# EAGLE design 086-005 (EAGLE 7.5.0)
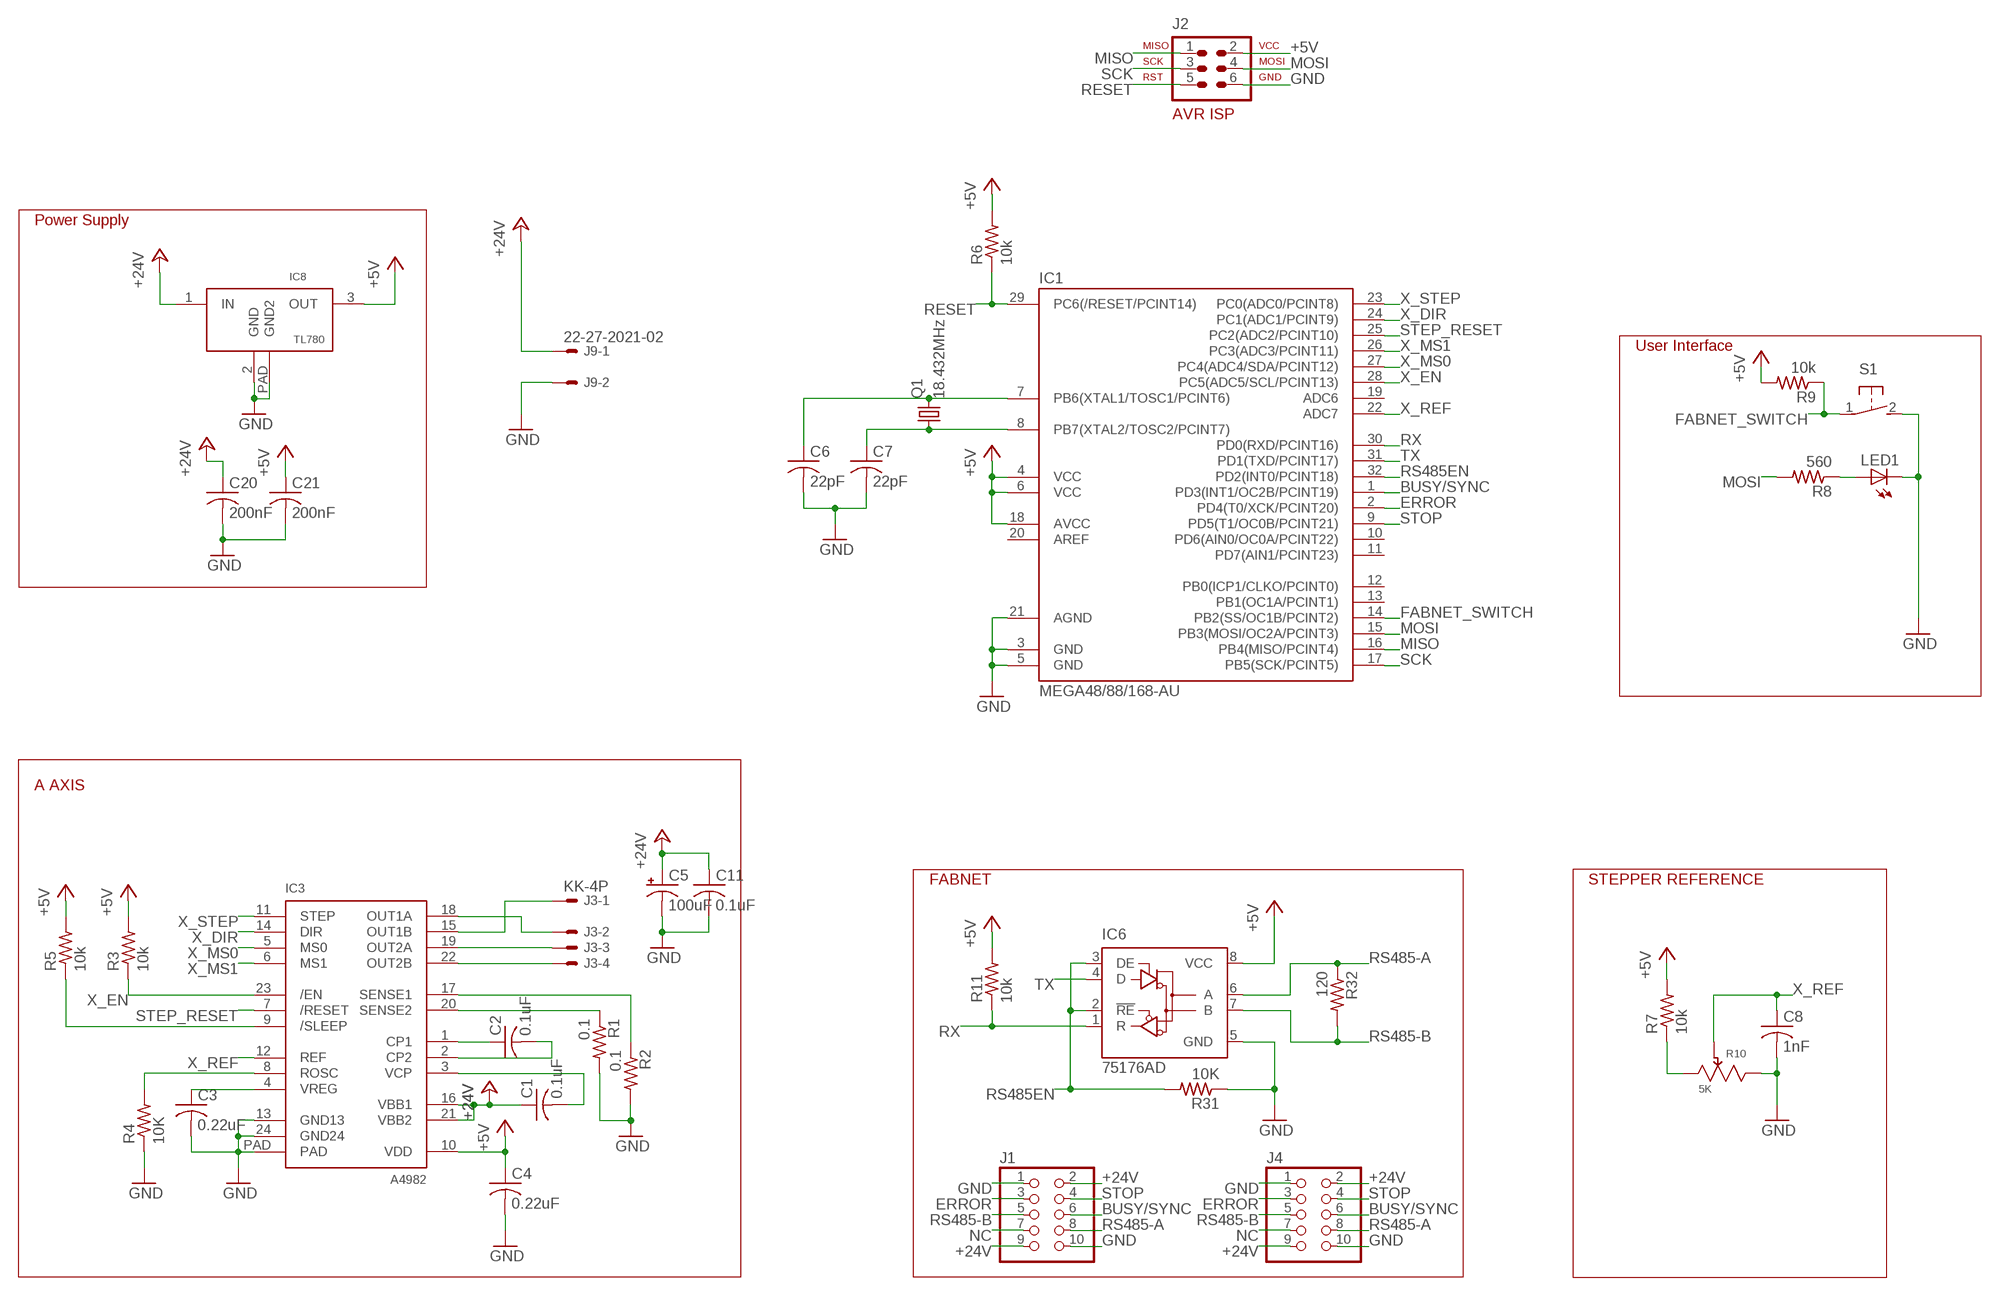
[diagram p0: schematic, sheet 1]

## Parts
C1  0.1uF  C-USC0805  [C0805]
C2  0.1uF  C-USC0805  [C0805]
C3  0.22uF  C-USC0805  [C0805]
C4  0.22uF  C-USC0805  [C0805]
C5  100uF  CPOL-USD  [PANASONIC_D]
C6  22pF  C-USC0805  [C0805]
C7  22pF  C-USC0805  [C0805]
C8  1nF  C-USC0805  [C0805]
C11  0.1uF  C-USC0805  [C0805]
C20  200nF  C-USC0805  [C0805]
C21  200nF  C-USC0805  [C0805]
IC1  MEGA48/88/168-AU  [TQFP32-08]
IC3  A4982  [TSSOP24_LP]
IC6  75176AD  [D_R-PDSO-G8]
IC8  TL780_VREG  [D2PAK-3]
J1  PINHD-2X5  [2X05]
J2  AVR-ISP-6VERT  [AVR-ISP-6]
J3  KK-4P  22-05-7048-04  [7395-04]
J4  PINHD-2X5  [2X05]
J9  22-27-2021-02  [6410-02]
LED1  LEDCHIPLED_0603  [CHIPLED_0603]
Q1  18.432MHz  CRYSTALHC49UP  [HC49UP]
R1  0.1  R-US_R1206  [R1206]
R2  0.1  R-US_R1206  [R1206]
R3  10k  R-US_R0805  [R0805]
R4  10K  R-US_R0805  [R0805]
R5  10k  R-US_R0805  [R0805]
R6  10k  R-US_R0805  [R0805]
R7  10k  R-US_R0805  [R0805]
R8  560  R-US_R0805  [R0805]
R9  10k  R-US_R0805  [R0805]
R10  5K  BOURN_POT  [BOURN_TRIM]
R11  10k  R-US_R0805  [R0805]
R31  10K  R-US_R0805  [R0805]
R32  120  R-US_R0805  [R0805]
S1  31-XX  [B3F-31XX]

## Nets
+5V: C4.1 C21.1 IC1.4(VCC) IC1.6(VCC) IC1.18(AVCC) IC3.10(VDD) IC6.8(VCC) IC8.3(OUT) J2.2 R3.2 R5.2 R6.2 R7.2 R9.2 R11.2
+24V: C1.1 C5.+ C11.1 C20.1 IC3.16(VBB1) IC3.21(VBB2) IC8.1(IN) J1.2 J1.9 J4.2 J4.9 J9.1
BUSY/SYNC: IC1.1(PD3(INT1/OC2B/PCINT19)) J1.6 J4.6
ERROR: IC1.2(PD4(T0/XCK/PCINT20)) J1.3 J4.3
FABNET_SWITCH: IC1.14(PB2(SS/OC1B/PCINT2)) R9.1 S1.1(P)
GND: C3.2 C4.2 C5.- C6.2 C7.2 C8.2 C11.2 C20.2 C21.2 IC1.3(GND) IC1.5(GND) IC1.21(AGND) IC3.13(GND13) IC3.24(GND24) IC3.PAD IC6.5(GND) IC8.2(GND) IC8.PAD(GND2) J1.1 J1.10 J2.6 J4.1 J4.10 J9.2 LED1.C R1.2 R2.2 R4.1 R10.3 R31.1 S1.2(S)
MISO: IC1.16(PB4(MISO/PCINT4)) J2.1
MOSI: IC1.15(PB3(MOSI/OC2A/PCINT3)) J2.4 R8.2
N2354: R7.1 R10.1
N$1: C6.1 IC1.7(PB6(XTAL1/TOSC1/PCINT6)) Q1.2
N$2: C7.1 IC1.8(PB7(XTAL2/TOSC2/PCINT7)) Q1.1
N$3: IC3.19(OUT2A) J3.3
N$4: IC3.22(OUT2B) J3.4
N$5: LED1.A R8.1
N$7: IC3.18(OUT1A) J3.2
N$8: IC3.15(OUT1B) J3.1
N$11: IC3.20(SENSE2) R1.1
N$12: IC3.17(SENSE1) R2.1
N$13: IC3.8(ROSC) R4.2
N$15: C1.2 IC3.3(VCP)
N$16: C2.1 IC3.1(CP1)
N$17: C2.2 IC3.2(CP2)
N$18: IC3.9(/SLEEP) R5.1
N$19: C3.1 IC3.4(VREG)
NC: J1.7 J4.7
RESET: IC1.29(PC6(/RESET/PCINT14)) J2.5 R6.1
RS485-A: IC6.6(A) J1.8 J4.8 R32.1
RS485-B: IC6.7(B) J1.5 J4.5 R32.2
RS485EN: IC1.32(PD2(INT0/PCINT18)) IC6.2(!RE) IC6.3(DE) R31.2
RX: IC1.30(PD0(RXD/PCINT16)) IC6.1(R) R11.1
SCK: IC1.17(PB5(SCK/PCINT5)) J2.3
STEP_RESET: IC1.25(PC2(ADC2/PCINT10)) IC3.7(/RESET)
STOP: IC1.9(PD5(T1/OC0B/PCINT21)) J1.4 J4.4
TX: IC1.31(PD1(TXD/PCINT17)) IC6.4(D)
X_DIR: IC1.24(PC1(ADC1/PCINT9)) IC3.14(DIR)
X_EN: IC1.28(PC5(ADC5/SCL/PCINT13)) IC3.23(/EN) R3.1
X_MS0: IC1.27(PC4(ADC4/SDA/PCINT12)) IC3.5(MS0)
X_MS1: IC1.26(PC3(ADC3/PCINT11)) IC3.6(MS1)
X_REF: C8.1 IC1.22(ADC7) IC3.12(REF) R10.2
X_STEP: IC1.23(PC0(ADC0/PCINT8)) IC3.11(STEP)
Unconnected: IC1.10(PD6(AIN0/OC0A/PCINT22)) IC1.11(PD7(AIN1/PCINT23)) IC1.12(PB0(ICP1/CLKO/PCINT0)) IC1.13(PB1(OC1A/PCINT1)) IC1.19(ADC6) IC1.20(AREF)

## Notes on the sheet
- Power Supply
- User Interface
- A AXIS
- FABNET | STEPPER REFERENCE

## Library data of the parts
C1-C4 C6-C8 C11 C20 C21 = rcl:C-US: CAPACITOR, American symbol
C5 = rcl:CPOL-US: POLARIZED CAPACITOR, American symbol
IC1 = avr-7:MEGA48/88/168
IC3 = unitoffab:A4982
IC6 = 751xx:75176A: DIFFERENTIAL BUS TRANSCEIVER Source: http://focus.ti.com/lit/ds/symlink/sn75176a.pdf
IC8 = MtMM:TL780_VREG
J1 J4 = pinhead:PINHD-2X5: PIN HEADER
J2 = avr-7:AVR-ISP-6: AVR ISP-6 Serial Programming Header
J3 = con-molex:22-?-04: CONNECTOR wire to board 2.54 mm (.1 inch) pitch header; OC_FARNELL: unknown; OC_NEWARK: unknown
J9 = con-molex:22-?-02: CONNECTOR wire to board 2.54 mm (.1 inch) pitch header; OC_FARNELL: unknown; OC_NEWARK: unknown
LED1 = led:LED: LED OSRAM: - CHIPLED LG R971, LG N971, LY N971, LG Q971, LY Q971, LO R971, LY R971 LH N974, LH R974 LS Q976, LO Q976, LY Q976 LO Q996 - Hyper CHIPLED LW Q18S LB Q993, LB Q99A, LB R99A - SideLED LS A670, LO A670, LY A670, LG A670, LP A670 LB A673, LV A673, LT A673, LW A673 LH A674 LY A675 LS A676, LA A676, LO A676, LY A676, LW A676 LS A679, LY A679, LG A679 - Hyper Micro SIDELED® LS Y876, LA Y876, LO Y876, LY Y876 LT Y87S - SmartLED LW L88C, LW L88S LB L89C, LB L89S, LG L890 LS L89K, LO L89K, LY L89K LS L896, LA L896, LO L896, LY L896 - TOPLED LS T670, LO T670, LY T670, LG T670, LP T670 LSG T670, LSP T670, LSY T670, LOP T670, LYG T670 LG T671, LOG T671, LSG T671 LB T673, LV T673, LT T673, LW T673 LH T674 LS T676, LA T676, LO T676, LY T676, LB T676, LH T676, LSB T676, LW T676 LB T67C, LV T67C, LT T67C, LS T67K, LO T67K, LY T67K, LW E67C LS E67B, LA E67B, LO E67B, LY E67B, LB E67C, LV E67C, LT E67C LW T67C LS T679, LY T679, LG T679 LS T770, LO T770, LY T770, LG T770, LP T770 LB T773, LV T773, LT T773, LW T773 LH T774 LS E675, LA E675, LY E675, LS T675 LS T776, LA T776, LO T776, LY T776, LB T776 LHGB T686 LT T68C, LB T68C - Hyper Mini TOPLED® LB M676 - Mini TOPLED Santana® LG M470 LS M47K, LO M47K, LY M47K Source: http://www.osram.convergy.de LUXEON: - LUMILED® LXK2-PW12-R00, LXK2-PW12-S00, LXK2-PW14-U00, LXK2-PW14-V00 LXK2-PM12-R00, LXK2-PM12-S00, LXK2-PM14-U00 LXK2-PE12-Q00, LXK2-PE12-R00, LXK2-PE12-S00, LXK2-PE14-T00, LXK2-PE14-U00 LXK2-PB12-K00, LXK2-PB12-L00, LXK2-PB12-M00, LXK2-PB14-N00, LXK2-PB14-P00, LXK2-PB14-Q00 LXK2-PR12-L00, LXK2-PR12-M00, LXK2-PR14-Q00, LXK2-PR14-R00 LXK2-PD12-Q00, LXK2-PD12-R00, LXK2-PD12-S00 LXK2-PH12-R00, LXK2-PH12-S00 LXK2-PL12-P00, LXK2-PL12-Q00, LXK2-PL12-R00 Source: www.luxeon.com KINGBRIGHT: KA-3528ASYC Source: www.kingbright.com
Q1 = crystal:CRYSTAL: CRYSTAL; OC_FARNELL: unknown; OC_NEWARK: unknown
R1-R9 R11 R31 R32 = rcl:R-US_: RESISTOR, American symbol
R10 = unitoffab:BOURN_POT
S1 = switch-omron:31-XX: OMRON SWITCH; MPN: B3F-3100; OC_FARNELL: 959704; OC_NEWARK: 36M3582

## Board
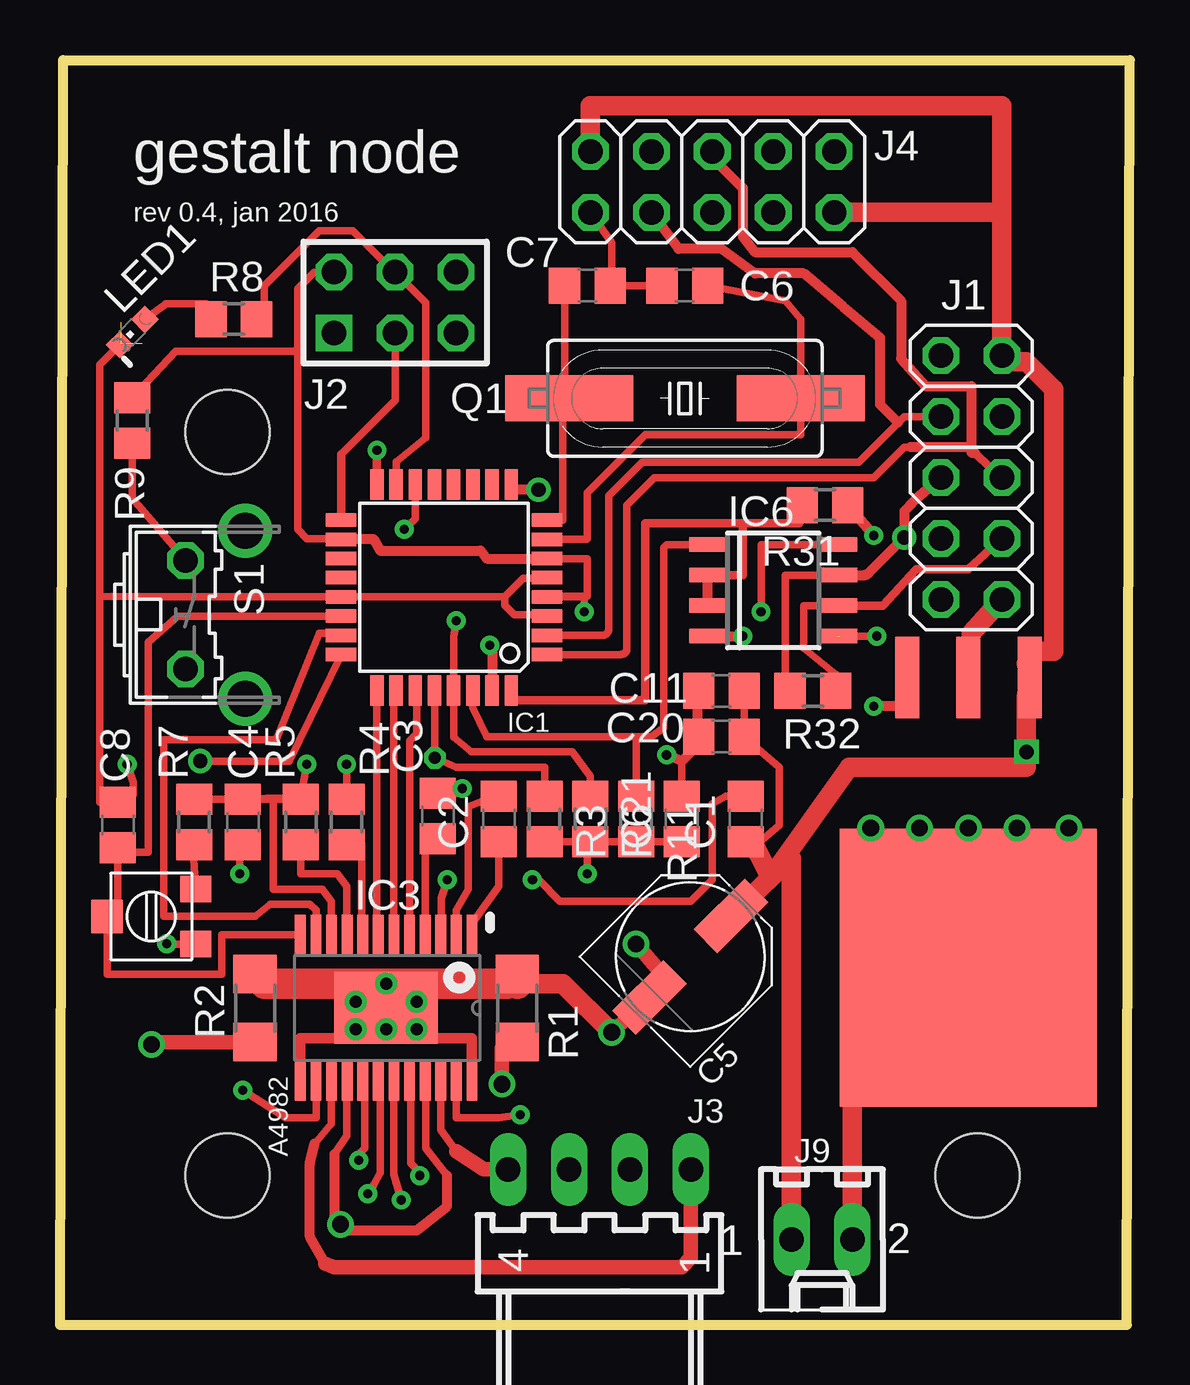
[diagram p1: board, top side]
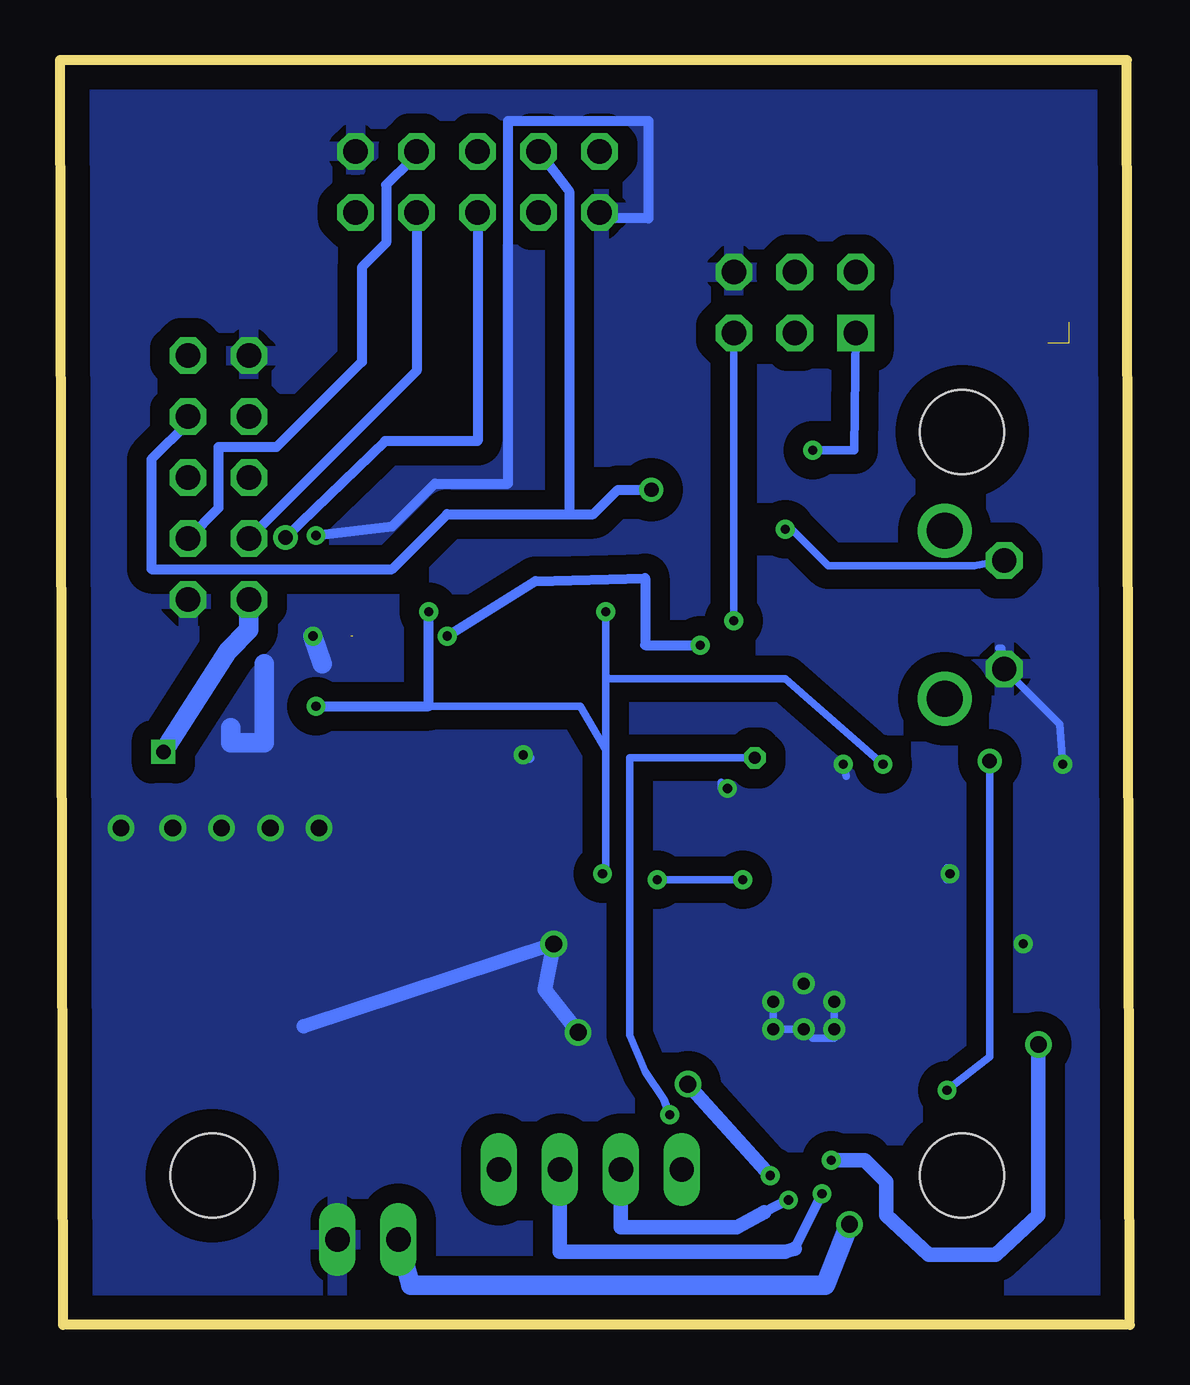
[diagram p2: board, bottom side, seen from below]

Size 44.58 x 52.7 mm. Coordinates in mm from the lower left corner, seen from the top.
Outline: 0,0 0.13,52.7 44.58,52.7 44.45,0 0,0
Copper layers (1*16): Top 0.035mm / dielectric 1.5mm / Bottom 0.035mm
Design rules "default": minimum track width 10mil, minimum drill 15mil, track to track 6mil, track to pad 6mil, pad to pad 6mil, via to via 6mil, smd to smd 0mil, copper to edge 40mil, drill to drill 8mil, minimum pad ring 10mil, minimum via ring 8mil, stop-mask expansion 4mil, vias tented up to drill 0mil, thermal gap 14mil
Holes 3.51 mm at 6.99,6.22 38.23,6.22 6.99,37.21

### Footprints (pad centres in the part's own frame; a part is rotated, then mirrored left to right if it is on the bottom)
C0805 = smd 1.3 x 1.5: 1 -0.95,0; 2 0.95,0
PANASONIC_D = smd 3 x 1.4: + 2.4,0; - -2.4,0
TQFP32-08 = smd 1.27 x 0.559: 1 -4.293,2.8; 2 -4.293,2; 3 -4.293,1.2; 4 -4.293,0.4; 5 -4.293,-0.4; 6 -4.293,-1.2; 7 -4.293,-2; 8 -4.293,-2.8; 17 4.293,-2.8; 18 4.293,-2; 19 4.293,-1.2; 20 4.293,-0.4; 21 4.293,0.4; 22 4.293,1.2; 23 4.293,2; 24 4.293,2.8 | smd 0.559 x 1.27: 9 -2.8,-4.293; 10 -2,-4.293; 11 -1.2,-4.293; 12 -0.4,-4.293; 13 0.4,-4.293; 14 1.2,-4.293; 15 2,-4.293; 16 2.8,-4.293; 25 2.8,4.293; 26 2,4.293; 27 1.2,4.293; 28 0.4,4.293; 29 -0.4,4.293; 30 -1.2,4.293; 31 -2,4.293; 32 -2.8,4.293
TSSOP24_LP = smd 0.45 x 1.65: 1 -3.575,-3.05; 2 -2.925,-3.05; 3 -2.275,-3.05; 4 -1.625,-3.05; 5 -0.975,-3.05; 6 -0.325,-3.05; 7 0.325,-3.05; 8 0.975,-3.05; 9 1.625,-3.05; 10 2.275,-3.05; 11 2.925,-3.05; 12 3.575,-3.05; 13 3.575,3.05; 14 2.925,3.05; 15 2.275,3.05; 16 1.625,3.05; 17 0.975,3.05; 18 0.325,3.05; 19 -0.325,3.05; 20 -0.975,3.05; 21 -1.625,3.05; 22 -2.275,3.05; 23 -2.925,3.05; 24 -3.575,3.05 | smd 4.32 x 3: PAD 0,0
D_R-PDSO-G8 = smd 0.6 x 1.5: 1 -1.905,-2.75; 2 -0.635,-2.75; 3 0.635,-2.75; 4 1.905,-2.75; 5 1.905,2.75; 6 0.635,2.75; 7 -0.635,2.75; 8 -1.905,2.75
D2PAK-3 = smd 1 x 3.4: 1 -2.55,-10.6; 2 0,-10.6; 3 2.55,-10.6 | smd 10.7 x 11.6: PAD 0,1.5
2X05 = drill 1.016 octagon: 1 -5.08,-1.27; 2 -5.08,1.27; 3 -2.54,-1.27; 4 -2.54,1.27; 5 0,-1.27; 6 0,1.27; 7 2.54,-1.27; 8 2.54,1.27; 9 5.08,-1.27; 10 5.08,1.27
AVR-ISP-6 = drill 1.016 square: 1 -2.54,-1.27 | drill 1.016 octagon: 2 -2.54,1.27; 3 0,-1.27; 4 0,1.27; 5 2.54,-1.27; 6 2.54,1.27
7395-04 = drill 1.016 long: 1 3.81,0; 2 1.27,0; 3 -1.27,0; 4 -3.81,0
6410-02 = drill 1.016 long: 1 1.27,0; 2 -1.27,0
CHIPLED_0603 = smd 0.8 x 0.8: A 0,-0.75; C 0,0.75
HC49UP = smd 5.334 x 1.93: 1 -4.826,0; 2 4.826,0
R1206 = smd 1.6 x 1.803: 1 -1.422,0; 2 1.422,0
R0805 = smd 1.3 x 1.5: 1 -0.95,0; 2 0.95,0
BOURN_TRIM = smd 1.1 x 1.3: 1 1.15,-1.85; 3 -1.15,-1.85 | smd 1.4 x 1.3: 2 0,1.85
B3F-31XX = drill 1.016 octagon: 1 -2.261,-1.245; 2 2.261,-1.245 | drill 1.499 pad 2.159: 3 -3.505,1.245; 4 3.505,1.245

### Placement (x,y rotation side)
C1  28.57,21.08 90 top
C2  18.29,21.08 90 top
C3  15.75,21.21 90 top
C4  7.62,20.95 270 top
C5  26.26,15.35 45 top
C6  26.04,43.31 180 top
C7  21.97,43.31 0 top
C8  2.41,20.83 90 top
C11  27.56,26.42 180 top
C20  27.56,24.51 180 top
C21  25.91,21.08 90 top
IC1  16,30.73 180 top
IC3  13.59,13.21 180 top
IC6  29.72,30.61 270 top
IC8  37.85,16.38 180 top
J1  37.97,35.31 270 top
J2  13.96,42.6 0 top
J3  22.48,6.48 0 top
J4  27.18,47.62 0 top
J9  31.75,3.56 180 top
LED1  3.01,41.36 135 top
Q1  26.04,38.61 0 top
R1  19.05,13.21 90 top
R2  8.13,13.21 90 top
R3  20.19,21.08 270 top
R4  11.94,20.95 270 top
R5  10.03,20.95 90 top
R6  22.1,21.08 270 top
R7  5.59,20.95 90 top
R8  7.24,41.91 0 top
R9  3.01,37.68 90 top
R10  3.81,17.02 90 top
R11  24,21.08 270 top
R31  31.88,34.16 180 top
R32  31.37,26.42 180 top
S1  6.48,29.59 270 top

### Tracks (layer width: path | path; a pad name or v marks a point on that pad's centre or on a via)
+5V  (via drill 0.38)
  Top 0.305: R7.2 C4.1 8.89,21.91 | 8.89,21.91 R5.2 5.65,21.91 10.03,21.97 v10.29,23.37 | IC3.10 11.3,17.65 10.92,18.16 8.89,18.16 8.89,21.91 | IC1.6 21.97,31.93 21.97,30.35 20.3,30.35 IC1.4 21.84,30.33 v21.84,29.72 | R3.2 21.97,20.13 | 21.97,20.13 R6.2 R11.2 C21.1 26.29,20.07 26.16,20.07 | v21.97,18.8 21.97,20.13 | IC6.8 29.21,32.51 v29.21,29.72 | IC1.18 11.68,32.77 10.29,32.77 9.91,33.15 9.91,40.57 9.78,40.57 | R9.2 4.82,40.57 9.78,40.57 | J2.2 10.59,43.87 9.91,43.18 9.91,40.69 9.78,40.57
  Top 0.406: IC1.18 13.08,32.73 13.34,32.26 17.53,32.26 17.78,31.93 IC1.6 | IC8.3 35.31,27.86 35.31,25.78 v33.91,25.78
  Bottom 0.305: v21.84,29.72 21.84,27.05 | 21.84,27.05 21.83,23.96 | 21.83,23.96 21.84,19.05 v21.97,18.8 | v10.29,23.37 14.35,26.92 21.72,26.92 21.84,27.05 | 29.21,25.78 22.89,25.78 21.83,23.96
  Bottom 0.406: v33.91,25.78 29.21,25.78 v29.21,29.72
+24V  (via drill 0.6, 0.7)
  Top 0.305: 11.94,10.16 IC3.16 11.94,10.13 11.94,7.87 11.43,7.11 | IC3.21 15.24,10.16 15.24,7.37 16.13,6.22 | C11.1 C20.1 28.64,24 29.08,24 29.97,23.24 29.97,20.83 28.96,19.94 29.15,20.13 C1.1
  Top 0.406: 11.43,7.11 11.43,4.57 v11.68,4.19 11.94,3.94 14.86,3.94 16.13,4.95 16.13,6.22
  Top 0.813: 29.59,18.67 29.72,18.8 32.89,23.24 40.27,23.24 v40.27,23.88 40.27,26.16 IC8.1 40.27,27.56 40.39,27.56 40.39,28.07 41.4,28.07 41.4,38.99 40.26,40.13 39.5,40.13 J1.2 39.24,46.35 | C5.+ 30.48,19.44 | 30.48,19.44 29.71,18.8 29.59,18.67 | 28.96,19.94 29.59,18.67 | J9.1 30.48,19.44 | J4.2 22.1,50.8 39.24,50.8 39.24,46.35 | J4.9 39.24,46.35
  Bottom 0.813: J9.1 29.97,1.65 12.7,1.65 v11.68,4.19 | J1.9 36.7,28.96 37.59,28.07 v40.27,23.88
BUSY/SYNC
  Top 0.305: 35.43,36.58 35.18,36.58 33.91,35.31 24.77,35.31 23.62,34.16 23.62,28.19 arc-90 23.37,27.93 IC1.1
  Top 0.356: 37.85,36.58 38.12,36.32 J1.6
  Top 0.406: 37.85,36.58 35.43,36.58 | J4.6 27.3,48.51 28.45,47.37 28.45,45.34 28.96,44.7 33.02,44.7 35.05,42.67 35.05,40.26 36.07,39.12 37.97,39.12 37.97,36.35 38.12,36.32
ERROR
  Top 0.305: J1.3 35.18,37.85 34.92,37.59 33.27,35.94 24.26,35.94 22.86,34.54 22.86,28.99 arc-90 22.61,28.73 IC1.2
  Top 0.406: 34.92,37.59 34.16,38.35 34.16,41.15 32.64,42.42 30.99,43.81 28.96,43.81 27.56,44.83 25.78,44.83 J4.3
FABNET_SWITCH  (via drill 0.38)
  Top 0.305: IC1.14 14.8,33.6 v14.35,33.15 | S1.1 3.01,34.45 R9.1
  Bottom 0.305: S1.1 6.48,31.62 12.57,31.62 14.1,33.15 v14.35,33.15
GND  (via drill 0.38, 0.5, 0.7)  (1 unrouted)
  Top 0.305: 10.03,10.14 IC3.13 | C21.2 25.91,23.5 | 32.38,28.7 v34.04,28.7 | C3.2 16.76,22.16 v16.76,22.35 | R4.1 v11.94,23.37 | C4.2 7.49,19.75 v7.49,18.8 | R10.3 4.57,15.87 v4.45,15.88 | 1.65,30.35 1.65,21.78 C8.2 2.73,21.78 3.05,22.1 3.05,22.61 v2.79,23.37 | 1.65,30.35 4.3,30.33 IC1.21 18.52,30.33 | LED1.C 1.65,40.01 1.65,30.35 | 26.54,24.13 26.61,24.2 C20.2 C11.2 | IC1.5 20.28,31.11 19.3,31.11 18.52,30.33 | IC1.3 20.24,29.59 18.92,29.59 18.52,29.99 18.52,30.33 | C6.2 C7.2 22.99,43.37 22.99,45.09 J4.1
  Top 0.406: C11.2 26.54,25.97 26.54,24.13 25.91,23.5 v25.27,23.75 | R31.1 v33.91,32.89
  Top 0.432: IC3.24 17.16,11.94 13.59,11.94 | 13.59,11.94 v13.59,12.32 IC3.PAD | IC3.13 10.01,11.94 13.59,11.94
  Top 0.61: R1.2 18.64,14.22 | v13.59,14.22 IC3.PAD | R2.2 8.53,14.22 | 35.29,12.08 35.43,11.94 | 35.43,11.94 35.81,11.56 | 35.81,11.56 35.94,11.43 38.48,12.06 41.27,12.06 | 41.27,12.06 39.24,12.57 38.23,12.32 | 37.59,13.21 38.73,13.21 34.54,18.92 36.83,15.24 34.04,14.48 | 40.64,11.43 41.27,12.06 | 41.27,12.06 39.88,12.19 39.88,12.57 41.4,14.1 41.02,14.73 | 35.31,15.11 35.18,14.99 34.42,13.72 33.01,15.88 | 35.69,13.59 36.83,16 36.72,15.41 36.2,12.7 35.43,11.94 | 36.45,13.21 35.81,11.56 | 38.35,11.56 37.85,11.3 38.23,12.32 | 38.23,12.32 41.27,12.06 | 41.27,12.06 39.5,10.82 IC8.PAD | C5.- 24.51,13.59 v22.99,12.19 | 25.53,14.1 v24,15.88 | 38.73,13.72 42.04,17.27 40.39,13.72 38.72,14.15 35.94,14.86 38.73,13.72
  Top 0.813: IC8.2 37.97,28.83 J1.10 | J9.2 33.01,4.69 33.01,15.88 | 19.05,14.22 20.95,14.22 v22.99,12.19 | v33.78,20.7 33.91,20.7 33.91,19.05 34.54,19.05 34.54,18.92 | v35.81,20.7 35.94,20.7 35.94,19.43 | v37.85,20.7 37.85,19.05 | v39.88,20.7 40.01,20.7 40.01,19.43 | v42.04,20.7 42.04,18.8 | 36.83,15.24 36.72,15.24 36.72,15.41 | 38.73,13.21 38.99,13.21 38.99,12.83 38.72,12.83 38.72,14.15
  Top 1.27: 18.64,14.22 v13.59,14.22 8.53,14.22 | R1.2 19.05,14.22
  Bottom 0.305: v12.32,13.46 v12.32,12.32 12.32,11.94 13.21,11.94 v13.59,12.32 v14.86,12.32 v14.86,13.46 | v34.04,28.7 33.91,28.7 34.04,28.57 | v16.76,22.35 17.02,22.35 17.02,22.61 | 11.81,22.86 v11.94,23.37 | v7.49,18.8 7.62,19.05 7.62,18.54 | v4.45,15.88 4.19,15.88 | 5.46,28.19 5.33,28.19 S1.2 2.92,25.02 v2.79,23.37
  Bottom 0.406: v25.27,23.75 25.4,23.62 25.02,23.62 | v33.91,32.89 30.73,33.27 28.96,35.05 25.91,35.05 25.91,50.16 20.07,50.16 20.07,46.1 22.1,46.1 J4.1
  Bottom 0.61: v22.99,12.19 24.38,13.97 v24,15.88 34.42,12.45
  Bottom 0.813: 37.47,24.89 37.47,24.26 36.07,24.26 36.07,27.56 | 33.66,27.56 v34.04,28.7
  pour Bottom (isolate 0.813): 0.38,52.45 44.32,52.45 44.32,0.13 0.13,0.13
MISO  (via drill 0.38)
  Top 0.356: v13.21,36.45 13.2,35.69 IC1.16
  Bottom 0.356: J2.1 11.47,36.45 v13.21,36.45
MOSI
  Top 0.305: 13.97,35.06 IC1.15 14,35.97 15.24,36.96 15.24,42.59 J2.4 13.92,43.87 12.19,45.59 10.79,45.59 8.51,43.31 8.51,42.23 R8.2
N2354
  Top 0.305: R7.1 5.53,20 R10.1
N$1
  Top 0.305: IC1.7 21.94,32.73 21.97,32.77 21.97,34.67 24.38,37.08 30.86,37.08 Q1.2 30.86,41.91 30.23,42.67 C6.1
N$2
  Top 0.305: C7.1 21.02,39.43 Q1.1 20.95,38.23 20.95,33.53 IC1.8
N$3  (via drill 0.38)
  Top 0.305: IC3.19 13.91,6.28 v14.22,5.21
  Bottom 0.406: v14.22,5.21 15.24,4.7
  Bottom 0.61: 15.24,4.7 16.38,4.06 21.21,4.06 J3.3
N$4
  Top 0.305: IC3.22 15.86,8.14 16.51,7.24
  Top 0.61: J3.4 17.65,6.48 16.51,7.24
N$5
  Top 0.305: LED1.A 4.35,42.48 4.41,42.55 6.1,42.55 6.29,42.35 R8.1
N$6  (2 unrouted)
N$7  (via drill 0.38)
  Top 0.305: IC3.18 13.34,10.09 13.34,6.35 13.08,5.84 v12.83,5.46
  Bottom 0.406: 13.97,3.17 v12.83,5.46
  Bottom 0.61: 13.97,3.17 14.35,3.05 23.75,3.05 J3.2
N$8
  Top 0.305: 10.6,7.56 11.3,8.38 11.3,10.15 IC3.15
  Top 0.406: 11.05,2.54 10.41,3.68 10.41,6.73 10.6,7.56
  Top 0.61: J3.1 26.29,2.79 25.91,2.41 11.43,2.41 11.05,2.54
N$11  (via drill 0.38, 0.7)
  Top 0.305: IC3.20 14.61,10.12 14.61,6.73 14.99,6.35 v14.99,6.22
  Top 0.61: R1.1 18.41,11.53 v18.41,10.03
  Bottom 0.61: v18.41,10.03 v14.99,6.22
N$12  (via drill 0.38, 0.7)
  Top 0.305: IC3.17 12.57,10.12 12.7,9.99 12.7,7.37 12.45,7.11 v12.45,6.86 | 7.87,11.68 8.13,11.18 R2.1
  Top 0.61: v3.81,11.68 4.17,11.79 R2.1
  Bottom 0.61: v12.45,6.86 11.05,6.86 10.16,5.97 10.16,4.57 8.38,2.92 5.59,2.92 3.81,4.57 v3.81,11.68
N$13
  Top 0.305: IC3.8 12.57,16.3 12.57,20.07 12.51,20 R4.2
N$15  (via drill 0.38)
  Top 0.305: IC3.3 15.88,16.27 15.88,17.78 v16.13,18.54 | C1.2 27.75,22.03 27.18,21.72 27.18,18.54 26.29,17.65 20.83,17.65 19.94,18.54 v19.68,18.54
  Bottom 0.305: v16.13,18.54 v19.68,18.54
N$16
  Top 0.305: C2.1 18.29,18.29 17.27,16.89 17.16,16.78 IC3.1
N$17
  Top 0.305: IC3.2 16.51,17.27 17.02,18.16 17.02,21.59 18.09,22.03 C2.2
N$18
  Top 0.305: IC3.9 11.94,16.28 11.94,18.29 11.56,18.8 10.03,18.8 R5.1
N$19
  Top 0.305: IC3.4 15.21,19.73 C3.1
NC
  Bottom 0.406: J4.7 29.72,39.75 J1.7
RESET  (via drill 0.38)
  Top 0.305: IC1.29 16.4,24.49 17.14,23.88 21.34,23.88 22.1,22.86 R6.1 | 16.38,26.46 IC1.29 | v16.51,29.34 16.4,28.68 IC1.29
  Bottom 0.305: J2.5 16.5,31.25 v16.51,29.34
RS485-A
  Top 0.305: R32.1 32.32,27.12 30.99,28.19 30.99,29.97 IC6.6
  Top 0.356: IC6.6 34.29,29.97 35.69,31.5 37.85,31.5 J1.8
  Bottom 0.406: J1.8 37.97,34.04 37.97,36.58 35.56,36.58 32,40.13 32,44.07 31.88,44.2 30.99,45.09 30.99,47.5 29.97,48.51 J4.8
RS485-B  (via drill 0.6 pad 0.25)
  Top 0.305: R32.2 30.42,26.74 30.23,27.18 30.23,31.24 IC6.7
  Top 0.406: IC6.7 33.5,31.24 arc45 33.68,31.32 v35.18,32.81 arc45 v35.18,32.81 35.18,33.91 35.49,34.22 arc-45 35.41,34.16 35.69,34.42 J1.5
  Bottom 0.406: v35.18,32.81 31.03,36.83 27.18,36.83 J4.5
RS485EN
  Top 0.356: 18.8,26.04 24.38,26.04 24.38,33.4 28.45,33.4 | 28.45,33.4 28.45,31.24 IC6.2 | R31.2 30.8,33.4 28.45,33.4
  Top 0.406: IC6.2 IC6.3 | IC1.32 18.8,26.04
RX
  Top 0.305: IC6.1 25.27,32.51 25.15,32.38 25.15,24.89 24.64,24.51 24,24.51 | 24,24.51 17.78,24.51 17.2,25.72 IC1.30 | R11.1 24,24.51
SCK
  Top 0.305: J2.3 13.96,38.53 11.71,36.28
  Top 0.356: 11.71,36.28 IC1.17
STEP_RESET
  Top 0.305: IC1.25 13.2,16.32 IC3.7
STOP  (via drill 0.6 pad 0.25)
  Top 0.406: v19.94,34.8 19.03,34.8 IC1.9
  Bottom 0.406: J1.4 39.24,37.59 40.77,36.07 40.77,31.5 30.73,31.5 28.45,33.78 23.24,33.78 | 23.24,33.78 22.35,33.78 21.34,34.8 v19.94,34.8 | J4.4 23.37,47.24 23.37,33.91 23.24,33.78
TX  (via drill 0.38)
  Top 0.406: 27.69,28.7 IC6.4 v28.45,28.7 | v17.91,28.32 18,28.32 IC1.31
  Bottom 0.406: v28.45,28.7 24.77,30.99 20.19,31.11 20.19,28.32 v17.91,28.32
X_DIR  (via drill 0.38, 0.6)
  Top 0.305: v7.62,9.78 9.4,8.64 10.67,8.64 IC3.14 | IC1.24 9.56,23.5 v5.84,23.5
  Bottom 0.305: v5.84,23.5 5.84,11.18 v7.62,9.78
X_EN  (via drill 0.38, 0.5)
  Top 0.305: IC3.23 16.51,8.64 18.29,8.64 v19.18,8.76 | IC1.28 15.62,26.42 v15.62,23.62 16.51,23.24 20.19,23.24 R3.1
  Bottom 0.305: v15.62,23.62 20.83,23.62 20.83,12.06 20.19,10.54 19.43,9.4 v19.18,8.76
X_MS0
  Top 0.305: IC3.5 14.56,24.34 14.86,24.64 14.86,26.38 IC1.27
X_MS1
  Top 0.305: IC3.6 13.91,26.35 IC1.26
X_REF
  Top 0.305: 11.65,29.59 IC1.22 4.9,29.53 3.68,28.45 3.68,19.68 1.97,19.68 C8.1 2.41,17.4 R10.2 1.96,14.61 6.73,14.61 6.73,16.26 IC3.12
X_STEP
  Top 0.305: IC3.11 10.67,17.27 10.41,17.53 8.76,17.53 8.13,17.02 4.32,17.02 4.32,24.38 9.02,24.38 10.79,28.83 11.61,28.83 IC1.23

### Text on the board
tSilk: gestalt node | rev 0.4, jan 2016